# EAGLE schematic PowerMeterShield (EAGLE 6.4)
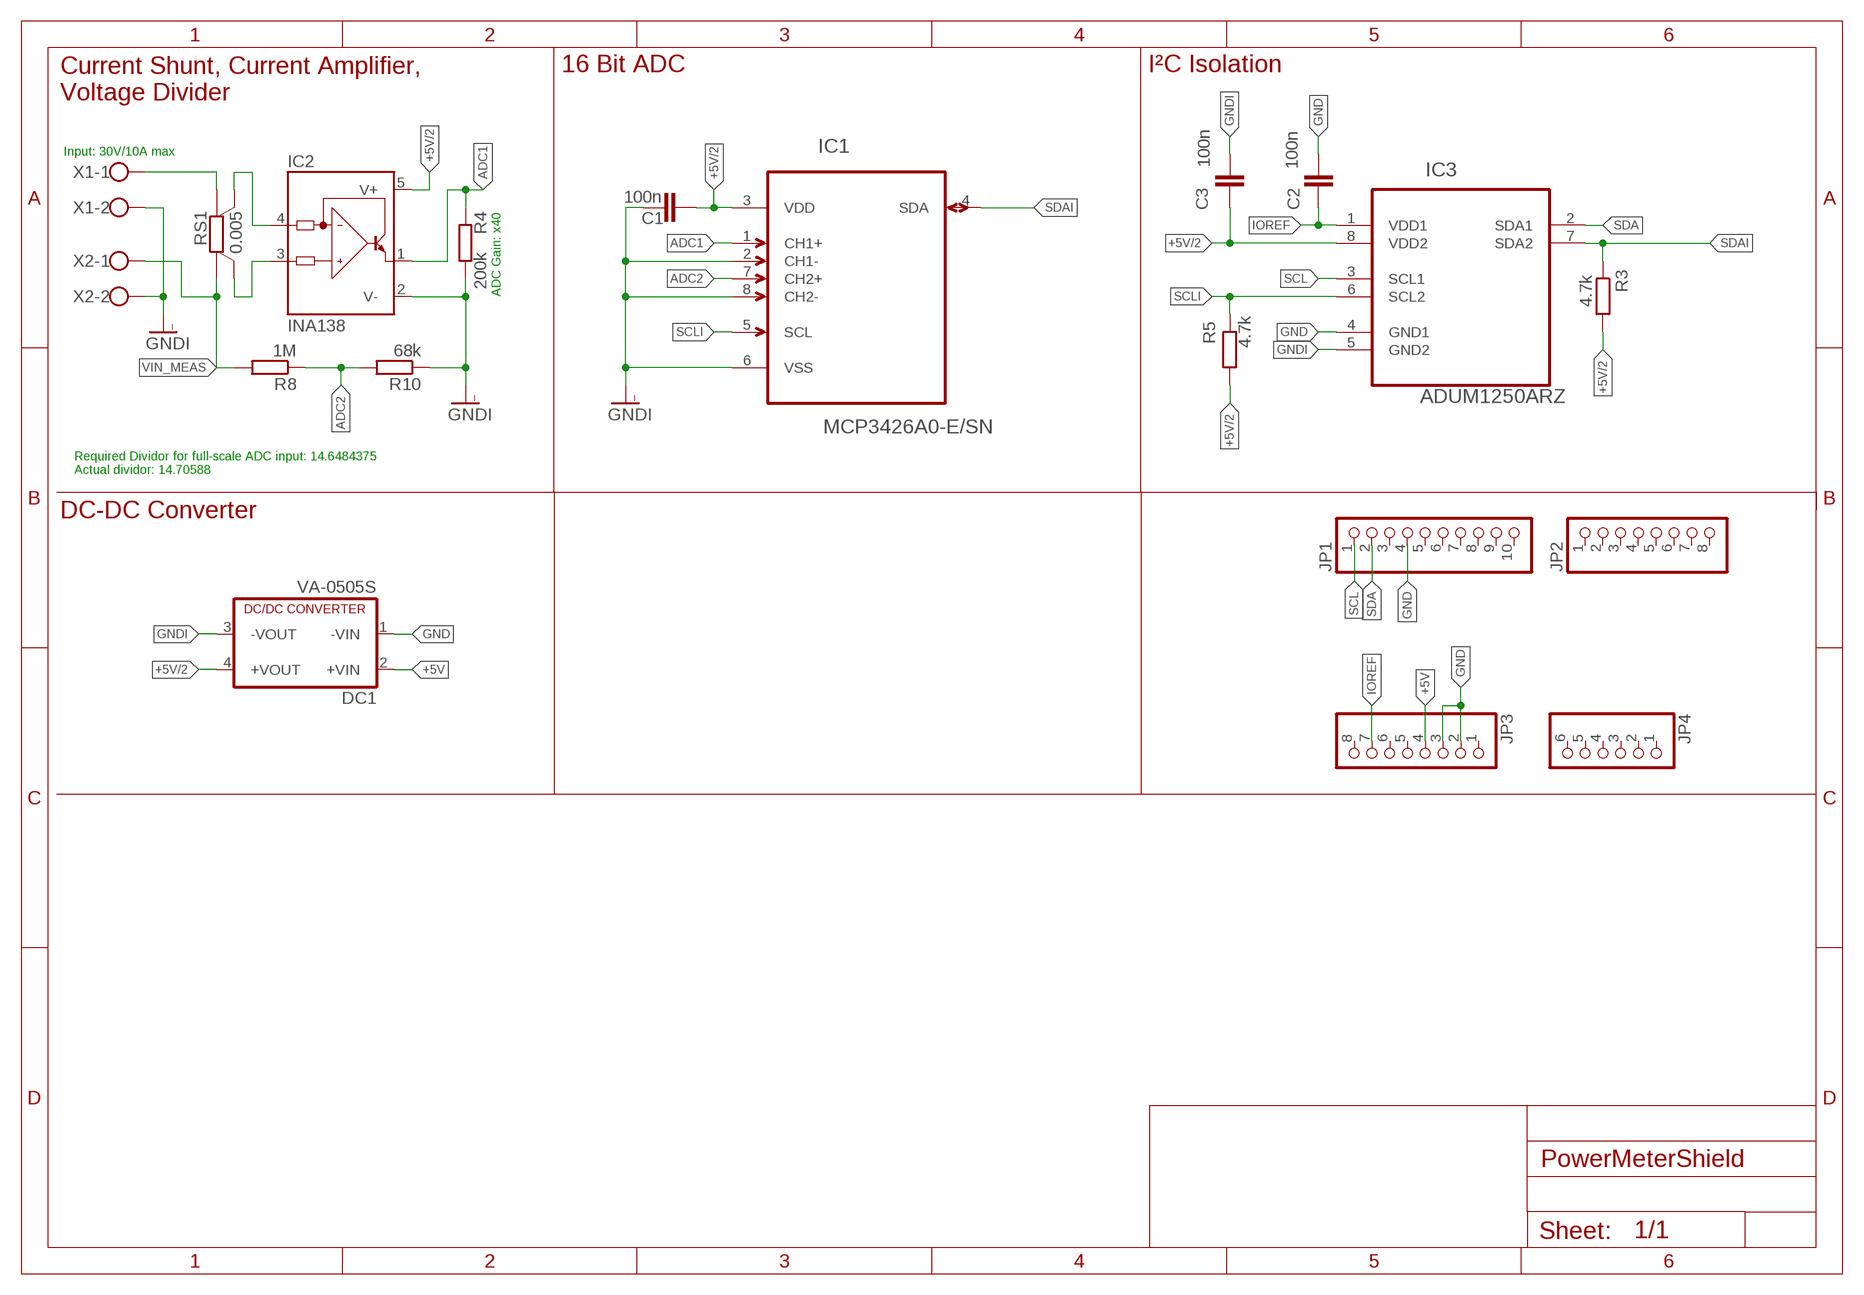
[diagram p0: schematic, sheet 1]

## Parts
C1  100n  C-EUC0805  [C0805]
C2  100n  C-EUC0805  [C0805]
C3  100n  C-EUC0805  [C0805]
DC1  VA-0505S  [4SIL]
IC1  MCP3426A0-E/SN  [SOIC127P600X175-8N]
IC2  INA138  [SOT23-5]
IC3  ADUM1250ARZ  [SOIC127P600X175-8N]
JP1  PINHD-1X10  [1X10]
JP2  PINHD-1X8  [1X08]
JP3  PINHD-1X8  [1X08]
JP4  PINHD-1X6  [1X06]
R3  4.7k  R-EU_R0805  [R0805]
R4  200k  R-EU_R0805  [R0805]
R5  4.7k  R-EU_R0805  [R0805]
R8  1M  R-EU_R0805  [R0805]
R10  68k  R-EU_R0805  [R0805]
RS1  0.005  SHUNT-4CSM3675M  [CSM3637M]
X1  W237-102  [W237-102]
X2  W237-102  [W237-102]

## Nets
+5V: DC1.2(+VIN) JP3.4
+5V/2: C1.1 C3.1 DC1.4(+VOUT) IC1.3(VDD) IC2.5(V+) IC3.8(VDD2) R3.2 R5.2
ADC1: IC1.1(CH1+) IC2.1(OUT) R4.2
ADC2: IC1.7(CH2+) R8.1 R10.2
GND: C2.2 DC1.1(-VIN) IC3.4(GND1) JP1.4 JP3.2 JP3.3
GNDI: C1.2 C3.2 DC1.3(-VOUT) IC1.2(CH1-) IC1.6(VSS) IC1.8(CH2-) IC2.2(V-) IC3.5(GND2) R4.1 R10.1 X1.2 X2.2
IOREF: C2.1 IC3.1(VDD1) JP3.7
N$1: IC2.3(IN+) RS1.S1
N$2: IC2.4(IN-) RS1.S2
N$5 [highpower]: RS1.I2 X1.1
SCL: IC3.3(SCL1) JP1.1
SCLI: IC1.5(SCL) IC3.6(SCL2) R5.1
SDA: IC3.2(SDA1) JP1.2
SDAI: IC1.4(SDA) IC3.7(SDA2) R3.1
VIN_MEAS [highpower]: R8.2 RS1.I1 X2.1
Unconnected: JP1.3 JP1.5 JP1.6 JP1.7 JP1.8 JP1.9 JP1.10 JP2.1 JP2.2 JP2.3 JP2.4 JP2.5 JP2.6 JP2.7 JP2.8 JP3.1 JP3.5 JP3.6 JP3.8 JP4.1 JP4.2 JP4.3 JP4.4 JP4.5 JP4.6

## Notes on the sheet
- Current Shunt, Current Amplifier,
  Voltage Divider
- 16 Bit ADC | I²C Isolation
- Input: 30V/10A max
- ADC Gain: x40
- Required Dividor for full-scale ADC input: 14.6484375
  Actual dividor: 14.70588
- DC-DC Converter

## Library data of the parts
C1-C3 = rcl:C-EU: CAPACITOR, European symbol; OC_FARNELL: 2310707; PRICE_100: 0.005
DC1 = dc-dc-converter:VA-*?: DC DC Converter Single Output, 1 Watt Motien Technology Co.,Ltd. Source: va-serie.pdf; OC_FARNELL: 2079696; OC_NEWARK: unknown
IC1 = MCP3428:MCP3426A0-E/SN: Analog-to-Digital Converter; MPN: MCP3426A0-E/SN; OC_FARNELL: 1825012; OC_NEWARK: 52R9954; PACKAGE: SOIC-8; PRICE_10: 2.06; SUPPLIER: Microchip
IC2 = burr-brown:INA138: High-Side Measurement Current Shunt Monitor; MF: TEXAS INSTRUMENTS; MPN: INA138NA/250; OC_DIGIKEY: INA168NADKR-ND; OC_FARNELL: 1206900RL; OC_NEWARK: 80K5906; PRICE_10: 1.21
IC3 = Adum1250:ADUM1250ARZ: Hot Swappable, Dual I2C Isolators; MPN: ADUM1250ARZ; OC_FARNELL: 1814353; OC_NEWARK: 27M9880; PACKAGE: SOIC-8; SUPPLIER: Analog Devices
JP1 = pinhead:PINHD-1X10: PIN HEADER
JP2 JP3 = pinhead:PINHD-1X8: PIN HEADER
JP4 = pinhead:PINHD-1X6: PIN HEADER
R3 R5 = rcl:R-EU_: RESISTOR, European symbol; OC_FARNELL: 2129167; PRICE_100: 0.001
R4 = rcl:R-EU_: RESISTOR, European symbol; OC_FARNELL: 2129299; PRICE_100: 0.001
R8 = rcl:R-EU_: RESISTOR, European symbol; OC_FARNELL: 2129354; PRICE_100: 0.001
R10 = rcl:R-EU_: RESISTOR, European symbol; OC_FARNELL: 2129265; PRICE_100: 0.001
RS1 = R-Vishay:SHUNT-4; OC_FARNELL: 1107419RL; PRICE_10: 0.844
X1 X2 = con-wago-500:W237-102: WAGO SCREW CLAMP; MPN: 237-102; OC_FARNELL: 1717001; OC_NEWARK: 70K9898; PRICE_10: 0.294

## Net classes
1 highpower: width 0.305 mm
2 isolated: clearance 20 mm